# Altium project USB_Hub.PrjPcb
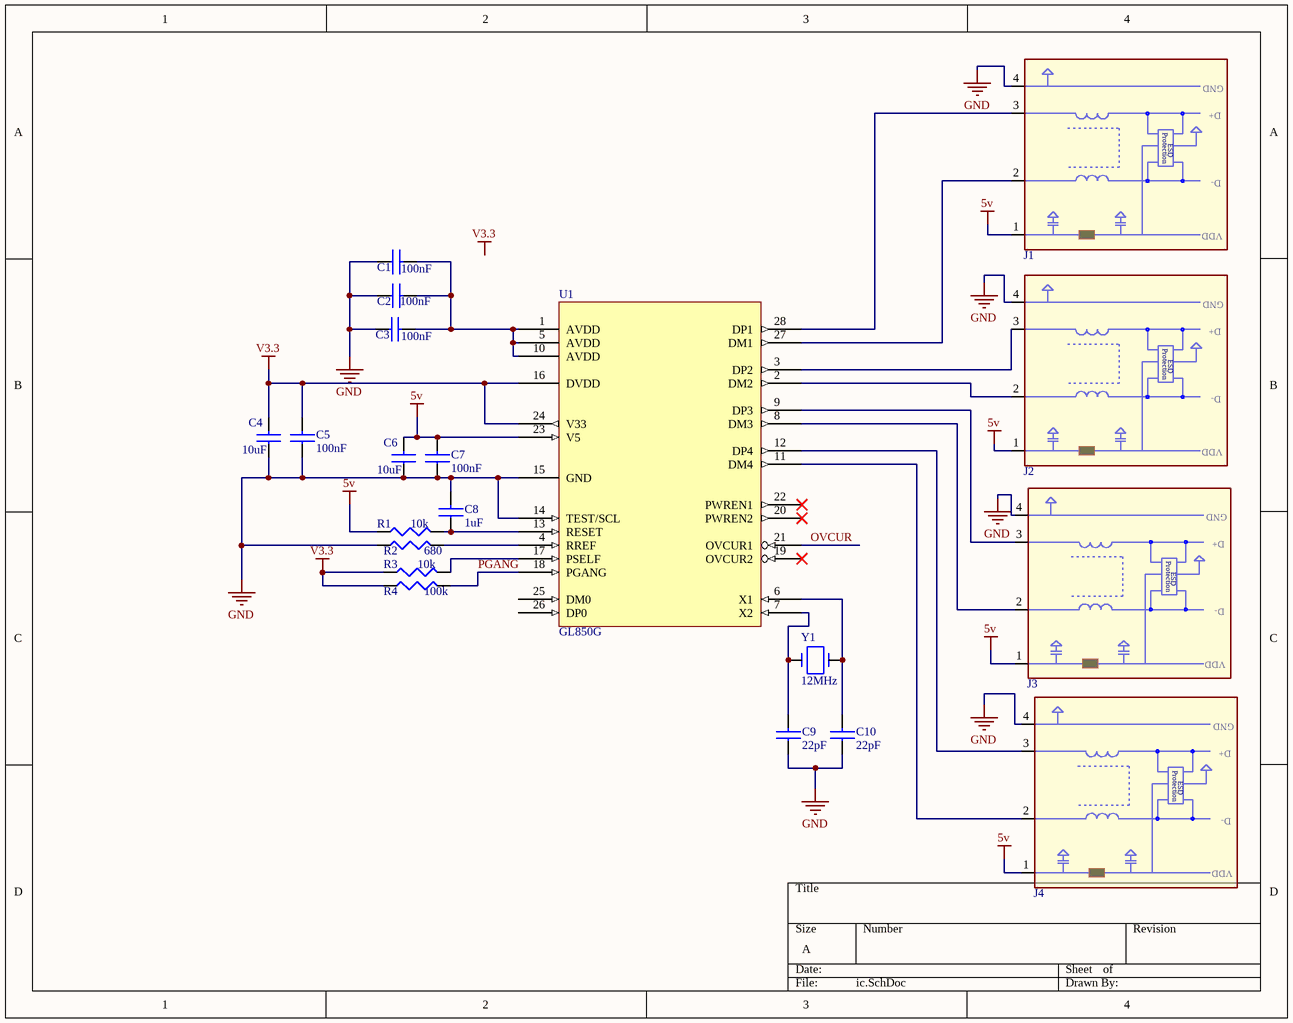
[diagram p0: ic.SchDoc]
1 sheet, 20 parts. Net scope: global (net labels, ports and power ports of the same name join across sheets).
Board file: pcb.PcbDoc

## Sheet ic.SchDoc
size A

### Parts
C1  100nF  [C0805]
C2  100nF  [C0805]
C3  100nF  [C0805]
C4  10uF  [C0805]
C5  100nF  [C0805]
C6  10uF  [C0805]
C7  100nF  [C0805]
C8  1uF  [C0805]
C9  22pF  [C0805]
C10  22pF  [C0805]
J1  8492121  [WE-EPLE]  (value not drawn)
J2  8492121  [WE-EPLE]  (value not drawn)
J3  8492121  [WE-EPLE]  (value not drawn)
J4  8492121  [WE-EPLE]  (value not drawn)
R1  10k  [R0805]
R2  680  [R0805]
R3  10k  [R0805]
R4  100k  [R0805]
U1  GL850G  [SOP65P780X200-28N]
Y1  12MHz  [ABM7_v1_1_BIG]

### Nets
5v: C6.2 C7.2 J1.1(VBUS) J2.1(VBUS) J3.1(VBUS) J4.1(VBUS) R1.1 U1.23(V5)
GND: C1.1 C2.1 C3.1 C4.1 C5.1 C6.1 C7.1 C8.2 C9.1 C10.1 J1.4(GND) J2.4(GND) J3.4(GND) J4.4(GND) R2.1 U1.14(TEST/SCL) U1.15(GND)
V3.3: C4.2 C5.2 R3.1 R4.1 U1.16(DVDD) U1.24(V33)
OVCUR: U1.21(OVCUR1)
PGANG: R4.2 U1.18(PGANG)
NetC1_2: C1.2 C2.2 C3.2 U1.1(AVDD) U1.5(AVDD) U1.10(AVDD)
NetC8_1: C8.1 R1.2 U1.13(RESET)
NetC9_2: C9.2 U1.7(X2) Y1.2
NetC10_2: C10.2 U1.6(X1) Y1.1
NetJ1_2: J1.2(D-) U1.27(DM1)
NetJ1_3: J1.3(D+) U1.28(DP1)
NetJ2_2: J2.2(D-) U1.2(DM2)
NetJ2_3: J2.3(D+) U1.3(DP2)
NetJ3_2: J3.2(D-) U1.8(DM3)
NetJ3_3: J3.3(D+) U1.9(DP3)
NetJ4_2: J4.2(D-) U1.11(DM4)
NetJ4_3: J4.3(D+) U1.12(DP4)
NetR2_2: R2.2 U1.4(RREF)
NetR3_2: R3.2 U1.17(PSELF)

Not connected (* = marked no-connect by the designer): U1 19(OVCUR2)* 20(PWREN2)* 22(PWREN1)* 25(DM0) 26(DP0)

### Notes on the sheet
- Labels drawn without touching a wire or pin: V3.3
- (in symbol WE-EPLE USB 2.0 A Connector, 8492121) Protection; ESD; VDD

### Library data of the parts
C1-C8 = C2012X7R1H104K085AA: CAP CER 0.1UF 50V 10% X7R 0805; Manufacturer: TDK Corporation; Capacitance: 0.1µF; .Creator: MM; .Checked PCB: RF; Supplier 1: Digi-Key; Manufacturer Part Number: C2012X7R1H104K085AA; RoHS: RoHS Compliant; Category: Capacitors; Stock 1: 818066; Pricing 1: 1=0.1, 10=0.066, 100=0.0303, 250=0.02476, 500=0.02118, 1000=0.0165 (USD); Packaging: Cut Tape (CT); Tolerance: ±10%; Voltage - Rated: 50V; Temperature Coefficient: X7R; Mounting Type: Surface Mount, MLCC; Operating Temperature: -55°C ~ 125°C; Applications: General Purpose; Ratings: -; Package / Case: 0805 (2012 Metric); Size / Dimension: 0.079" L x 0.049" W (2.00mm x 1.25mm); Height - Seated (Max): -; Thickness (Max): 0.037" (0.95mm); Lead Spacing: -; Features: -; Lead Style: -; ComponentLink1URL: http://product.tdk.com/en/catalog/datasheets/mlcc_commercial_general_en.pdf; ComponentLink1Description: http://product.tdk.com/en/catalog/datasheets/mlcc_commercial_general_en.pdf; Supplier Part Number 1: 445-7534-1-ND; .Checked SCH: RF
  C1-C3 C5 C7: value: 100nF
  C4 C6: value: 10uF
  C8: value: 1uF
C9 C10 = C0805C180J5GACTU: CAP CER 22pF 50V 5% NP0 0805; Manufacturer: Kemet; Capacitance: 18pF; Temperature Coefficient: C0G, NP0; .Creator: MM; .Checked PCB: RF; Supplier 1: Digi-Key; Manufacturer Part Number: C0805C180J5GACTU; RoHS: RoHS Compliant; Category: Capacitors; Stock 1: 39241; Pricing 1: 1=0.11, 10=0.083, 25=0.0588, 50=0.045, 100=0.0381, 250=0.0312, 1000=0.0204 (USD); Packaging: Cut Tape (CT); Tolerance: ±5%; Voltage - Rated: 50V; Mounting Type: Surface Mount, MLCC; Operating Temperature: -55°C ~ 125°C; Applications: General Purpose; Ratings: -; Package / Case: 0805 (2012 Metric); Size / Dimension: 0.079" L x 0.049" W (2.00mm x 1.25mm); Height - Seated (Max): -; Thickness (Max): 0.035" (0.88mm); Lead Spacing: -; Features: -; Lead Style: -; ComponentLink1URL: http://www.kemet.com/docfinder?Partnumber=C0805C180J5GACTU; ComponentLink1Description: http://www.kemet.com/docfinder?Partnumber=C0805C180J5GACTU; Supplier Part Number 1: 399-1112-1-ND; .Checked SCH: RF; value: 22pF
J1-J4 = WE-EPLE USB 2.0 A Connector, 8492121: THT USB 2.0 A Connector WE-EPLE; Manufacturer: Würth Elektronik eiSos GmbH; PartNo: 8492121; ComponentLink1Description: Manufacturer; ComponentLink1URL: http://www.we-online.de; Created by: Christin Otto; Created Date: OCT-2014; ComponentLink2Description: Datasheet; ComponentLink2URL: http://www.we-online.de/katalog/media/pdf/8492121.pdf
R1-R4 = RC0805FR-0710KL: RES SMD 10K OHM 1% 1/8W 0805; Manufacturer: Yageo; Power (Watts): 0.125W, 1/8W; Temperature Coefficient: ±100ppm/°C; .Creator: MM; .Checked PCB: RF; Supplier 1: Digi-Key; Manufacturer Part Number: RC0805FR-0710KL; RoHS: RoHS Compliant; Category: Resistors; Stock 1: 4094384; Pricing 1: 1=0.1, 10=0.021, 25=0.0148, 100=0.0084, 250=0.0064, 500=0.0051, 1000=0.00376, 2500=0.00326 (USD); Packaging: Cut Tape (CT); Resistance (Ohms): 10k; Tolerance: ±1%; Composition: Thick Film; Features: Moisture Resistant; Operating Temperature: -55°C ~ 155°C; Package / Case: 0805 (2012 Metric); Supplier Device Package: 0805; Size / Dimension: 0.079" L x 0.049" W (2.00mm x 1.25mm); Height: 0.024" (0.60mm); Number of Terminations: 2; ComponentLink1URL: http://www.yageo.com/documents/recent/PYu-RC_Group_51_RoHS_L_1.pdf; ComponentLink1Description: http://www.yageo.com/documents/recent/PYu-RC_Group_51_RoHS_L_1.pdf; Supplier Part Number 1: 311-10.0KCRCT-ND; .Checked SCH: RF
  R1 R3: value: 10k
  R2: value: 680
  R4: value: 100k
Y1 = ABM7-16.000MHZ-D2Y-T: CRYSTAL 16MHZ 18PF SMD; Manufacturer: Abracon LLC; Frequency Stability: ±30ppm; Frequency Tolerance: ±20ppm; ESR (Equivalent Series Resistance): 50 Ohm; Operating Mode: Fundamental; .Creator: MM; .Checked PCB: RF; Supplier 1: Digi-Key; Manufacturer Part Number: ABM7-16.000MHZ-D2Y-T; RoHS: RoHS Compliant; Category: Crystals and Oscillators; Stock 1: 5861; Pricing 1: 1=0.96, 10=0.847, 50=0.791, 100=0.7, 500=0.6615 (USD); Packaging: Cut Tape (CT); Type: MHz Crystal; Frequency: 16MHz; Load Capacitance: 18pF; Operating Temperature: -40°C ~ 85°C; Ratings: -; Mounting Type: Surface Mount; Package / Case: 2-SMD; Size / Dimension: 0.236" L x 0.138" W (6.00mm x 3.50mm); Height: 0.055" (1.40mm); ComponentLink1URL: http://www.abracon.com/Resonators/abm7.pdf; ComponentLink1Description: http://www.abracon.com/Resonators/abm7.pdf; Supplier Part Number 1: 535-9840-1-ND; .Checked SCH: RF; value: 12MHz